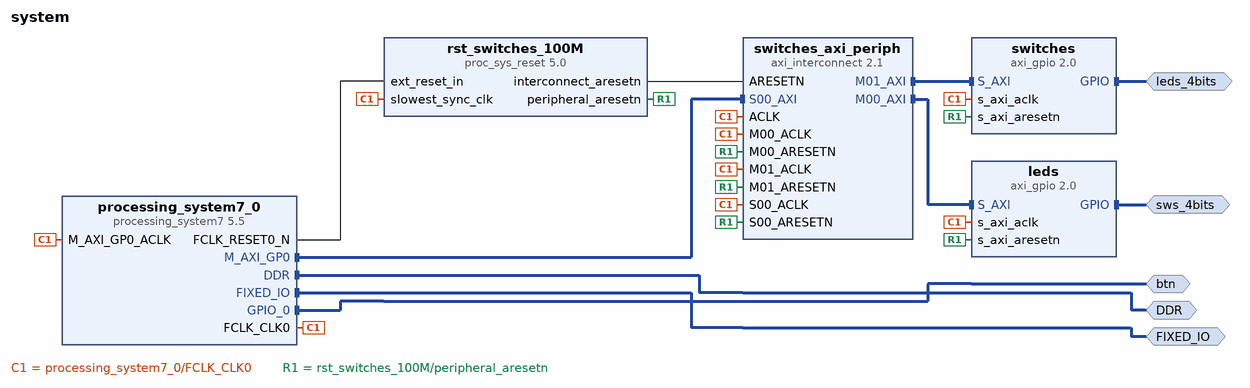
[diagram p0: block diagram of the top level]
# Vivado block design system, xc7z010clg400-1, Vivado 2017.2
create_bd_design system

create_bd_intf_port -mode Master -vlnv xilinx.com:interface:ddrx_rtl:1.0 DDR
create_bd_intf_port -mode Master -vlnv xilinx.com:display_processing_system7:fixedio_rtl:1.0 FIXED_IO
create_bd_intf_port -mode Master -vlnv xilinx.com:interface:gpio_rtl:1.0 sws_4bits
create_bd_intf_port -mode Master -vlnv xilinx.com:interface:gpio_rtl:1.0 leds_4bits
create_bd_intf_port -mode Master -vlnv xilinx.com:interface:gpio_rtl:1.0 btn

create_bd_cell -type ip -vlnv xilinx.com:ip:processing_system7:5.5 processing_system7_0
set_property -dict [list \
  CONFIG.PCW_UIPARAM_DDR_FREQ_MHZ 525 \
  CONFIG.PCW_CRYSTAL_PERIPHERAL_FREQMHZ 50.000000 \
  CONFIG.PCW_APU_PERIPHERAL_FREQMHZ 650 \
  CONFIG.PCW_SDIO_PERIPHERAL_FREQMHZ 50 \
  CONFIG.PCW_FPGA0_PERIPHERAL_FREQMHZ 100 \
  CONFIG.PCW_PRESET_BANK1_VOLTAGE {LVCMOS 1.8V} \
  CONFIG.PCW_UIPARAM_DDR_PARTNO {MT41K128M16 JT-125} \
  CONFIG.PCW_QSPI_PERIPHERAL_ENABLE 1 \
  CONFIG.PCW_QSPI_GRP_SINGLE_SS_ENABLE 1 \
  CONFIG.PCW_QSPI_GRP_FBCLK_ENABLE 1 \
  CONFIG.PCW_ENET0_PERIPHERAL_ENABLE 0 \
  CONFIG.PCW_SD0_PERIPHERAL_ENABLE 0 \
  CONFIG.PCW_UART1_PERIPHERAL_ENABLE 1 \
  CONFIG.PCW_USB0_PERIPHERAL_ENABLE 0 \
  CONFIG.PCW_GPIO_MIO_GPIO_ENABLE 1 \
  CONFIG.PCW_GPIO_EMIO_GPIO_ENABLE 1 \
  CONFIG.PCW_GPIO_EMIO_GPIO_IO 1 \
] [get_bd_cells processing_system7_0]
# 106 more settings of processing_system7_0 are not shown: defaults, MIO pin electricals, DDR timing, and values the tool derives
create_bd_cell -type ip -vlnv xilinx.com:ip:axi_gpio:2.0 leds
set_property -dict {CONFIG.USE_BOARD_FLOW true CONFIG.GPIO_BOARD_INTERFACE sws_4bits} [get_bd_cells leds]
create_bd_cell -type ip -vlnv xilinx.com:ip:axi_interconnect:2.1 switches_axi_periph
set_property -dict {CONFIG.NUM_MI 2} [get_bd_cells switches_axi_periph]
create_bd_cell -type ip -vlnv xilinx.com:ip:proc_sys_reset:5.0 rst_switches_100M
create_bd_cell -type ip -vlnv xilinx.com:ip:axi_gpio:2.0 switches
set_property -dict {CONFIG.USE_BOARD_FLOW true CONFIG.GPIO_BOARD_INTERFACE leds_4bits} [get_bd_cells switches]

# ---- connections ----

connect_bd_intf_net -intf_net switches_M_AXI_GP0 [get_bd_intf_pins processing_system7_0/M_AXI_GP0] [get_bd_intf_pins switches_axi_periph/S00_AXI]
connect_bd_intf_net [get_bd_intf_pins switches_axi_periph/M00_AXI] [get_bd_intf_pins leds/S_AXI]
connect_bd_intf_net [get_bd_intf_pins switches_axi_periph/M01_AXI] [get_bd_intf_pins switches/S_AXI]
connect_bd_intf_net [get_bd_intf_ports DDR] [get_bd_intf_pins processing_system7_0/DDR]
connect_bd_intf_net [get_bd_intf_ports FIXED_IO] [get_bd_intf_pins processing_system7_0/FIXED_IO]
connect_bd_intf_net -intf_net axi_gpio_0_GPIO [get_bd_intf_ports sws_4bits] [get_bd_intf_pins leds/GPIO]
connect_bd_intf_net -intf_net axi_gpio_1_GPIO [get_bd_intf_ports leds_4bits] [get_bd_intf_pins switches/GPIO]
connect_bd_intf_net -intf_net switches_GPIO_0 [get_bd_intf_ports btn] [get_bd_intf_pins processing_system7_0/GPIO_0]
connect_bd_net -net switches_FCLK_CLK0 [get_bd_pins processing_system7_0/FCLK_CLK0] \
  [get_bd_pins processing_system7_0/M_AXI_GP0_ACLK] [get_bd_pins switches_axi_periph/S00_ACLK] \
  [get_bd_pins rst_switches_100M/slowest_sync_clk] [get_bd_pins leds/s_axi_aclk] [get_bd_pins switches_axi_periph/M00_ACLK] \
  [get_bd_pins switches_axi_periph/ACLK] [get_bd_pins switches/s_axi_aclk] [get_bd_pins switches_axi_periph/M01_ACLK]
connect_bd_net -net switches_FCLK_RESET0_N [get_bd_pins processing_system7_0/FCLK_RESET0_N] [get_bd_pins rst_switches_100M/ext_reset_in]
connect_bd_net [get_bd_pins rst_switches_100M/peripheral_aresetn] \
  [get_bd_pins switches_axi_periph/S00_ARESETN] [get_bd_pins leds/s_axi_aresetn] \
  [get_bd_pins switches_axi_periph/M00_ARESETN] [get_bd_pins switches/s_axi_aresetn] \
  [get_bd_pins switches_axi_periph/M01_ARESETN]
connect_bd_net [get_bd_pins rst_switches_100M/interconnect_aresetn] [get_bd_pins switches_axi_periph/ARESETN]

# ---- address map ----
assign_bd_address -offset 0x41200000 -range 64K -target_address_space [get_bd_addr_spaces processing_system7_0/Data] [get_bd_addr_segs leds/S_AXI/Reg]
assign_bd_address -offset 0x41210000 -range 64K -target_address_space [get_bd_addr_spaces processing_system7_0/Data] [get_bd_addr_segs switches/S_AXI/Reg]

validate_bd_design
save_bd_design
